# Altium schematic sheet subckt_buffered_tia_dual.SchDoc
size B; SheetNumber: 4; SheetTotal: 5
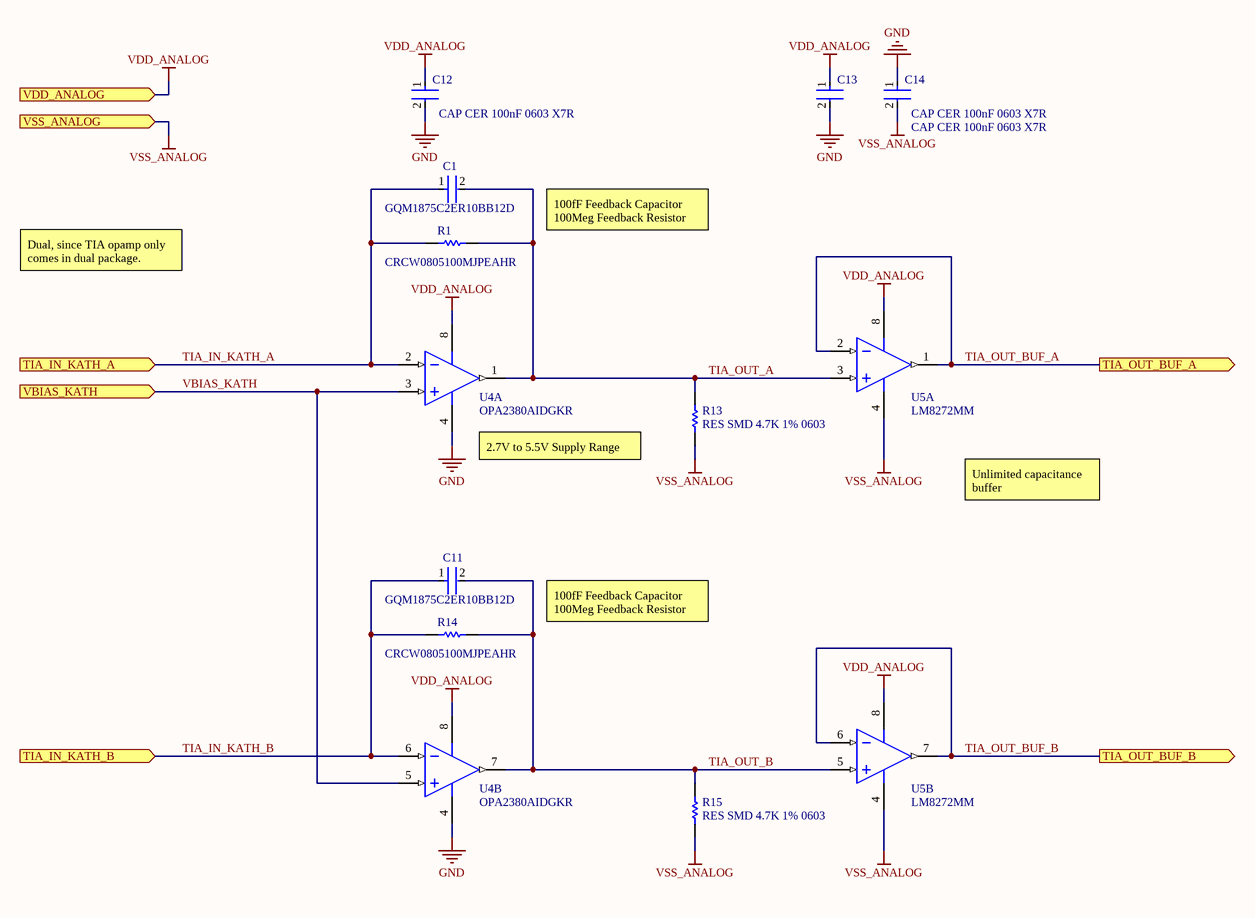
[diagram p0: subckt_buffered_tia_dual.SchDoc]

## Parts
C1  GQM1875C2ER10BB12D  [FP-GQM187-0_15-MFG]
C11  GQM1875C2ER10BB12D  [FP-GQM187-0_15-MFG]
C12  CAP CER 100nF 0603 X7R  [FP-CC0603-DA-MFG]
C13  CAP CER 100nF 0603 X7R  [FP-CC0603-DA-MFG]
C14  CAP CER 100nF 0603 X7R  [FP-CC0603-DA-MFG]
R1  CRCW0805100MJPEAHR  [RESC2013X50X30NL20T20]
R13  RES SMD 4.7K 1% 0603  [RESC1609X55X30LL15T15]
R14  CRCW0805100MJPEAHR  [RESC2013X50X30NL20T20]
R15  RES SMD 4.7K 1% 0603  [RESC1609X55X30LL15T15]
U4  OPA2380AIDGKR  [DGK0008A_N]  (parts A,B of 2)
U5  LM8272MM  [DGK0008A_L]  (parts A,B of 2)

## Ports
TIA_IN_KATH_A (in), TIA_IN_KATH_B (in), TIA_OUT_BUF_A (out), TIA_OUT_BUF_B (out), VBIAS_KATH (in), VDD_ANALOG (in), VSS_ANALOG (in)

## Nets
GND: C12.2 C13.2 C14.1 U4.4(V-)
VDD_ANALOG: C12.1 C13.1 U4.8(V+) U5.8(V+) ; port VDD_ANALOG
VSS_ANALOG: C14.2 R13.1 R15.1 U5.4(V-) ; port VSS_ANALOG
TIA_IN_KATH_A: C1.1 R1.1 U4.2(IN_A-) ; port TIA_IN_KATH_A
TIA_IN_KATH_B: C11.1 R14.1 U4.6(IN_B-) ; port TIA_IN_KATH_B
TIA_OUT_A: C1.2 R1.2 R13.2 U4.1(OUT_A) U5.3(INA+)
TIA_OUT_B: C11.2 R14.2 R15.2 U4.7(OUT_B) U5.5(INB+)
TIA_OUT_BUF_A: U5.1(OUTA) U5.2(INA-) ; port TIA_OUT_BUF_A
TIA_OUT_BUF_B: U5.6(INB-) U5.7(OUTB) ; port TIA_OUT_BUF_B
VBIAS_KATH: U4.3(IN_A+) U4.5(IN_B+) ; port VBIAS_KATH

## Notes on the sheet
- 100fF Feedback Capacitor
  100Meg Feedback Resistor
- Dual, since TIA opamp only comes in dual package.
- (near U4) 2.7V to 5.5V Supply Range
- Unlimited capacitance buffer

## Library data of the parts
C1 C11 = CMP-06035-052255-1: Ceramic Capacitor 0.1pF ±0.1pF 250VDC C0G 0603 Paper T/R; Voltage Rating: 250V; Width: 0.031inch; Length: 1.6mm; Max Operating Temperature: 125°C; Min Operating Temperature: -55°C; Height: 0.7mm; Dielectric: C0G; Termination: SMD/SMT; Depth: 0.8mm; Case/Package: 0603; Package Quantity: 4000; Radiation Hardening: No; Case Code (Metric): 1608; Thickness: 0.031inch; Capacitance: 0.1pF; Case Code (Imperial): 0603; Voltage Rating (DC): 250V; Packaging: Tape and Reel; Mount: Surface Mount
C12-C14 = CMP-03422-000030-1: CAP CER 0.1UF 16V X7R 0603; Manufacturer Part Number: CC0603KRX7R7BB104; Manufacturer: YAGEO; Tolerance: 0.1; Temperature Coefficient: 15%; Material: Ceramic; Voltage Rating: 16 V; Package: CC0603-DA; ComponentLink2Description: Datasheet; Octopart: https://octopart.com/cc0603krx7r7bb104-yageo-192941; Temperature Range High: +125°C; Digikey Description: CAP CER 0.1UF 16V X7R 0603; Value: 100 nF; Voltage: 16 V; Device Class L2: Capacitors; Height: 0.9mm; Temperature: -55°C to +125°C; Device Class L1: Passive Components; Device Class L3: Ceramic Capacitors; ComponentLink2URL: http://www.yageo.com/documents/recent/UPY-GPHC_X7R_6.3V-to-50V_18.pdf; Footprint Url: http://www.yageo.com/exep/pages/download/literatures/UPY-C_GEN_24.pdf; RoHS: TRUE; Temperature Range Low: -55°C; Temperature Characteristic: X7R; Lead Free: Yes; Capacitance: 100 nF; Category: Cap; Mouser Description: Multilayer Ceramic Capacitor, CC Series, 0.1 - F, - 10%, X7R, 16 V, 0603 [1608 Metric]; Automotive: No
R1 R14 = CMP-2001-04281-1: Manufacturer: Vishay Dale; Part Number: CRCW0805100MJPEAHR
R13 R15 = CMP-2000-07452-1: Chip Resistor, 10 KOhm, +/- 1%, 0.1 W, -55 to 155 degC, 0603 (1608 Metric), RoHS, Tape and Reel; Manufacturer: Panasonic; Voltage Rating: 75V; Case\/Package: 0603; Power Rating: 100mW; Resistance: 10KOhm; Temperature Coefficient: 100ppm\/degreesC; Number of Pins: 2; Package Reference: 603; Depth: 0.8mm; Mount: SurfaceMount; Package Description: 2-Pin Surface Mount Device, Body 1.6 x 0.85 mm; Datasheet Version: 02/2017; Length: 1.6mm; Lead Free: LeadFree; Height: 0.45mm; Number of Terminations: 2; Max Power Dissipation: 100mW; Min Operating Temperature: -55degC; Datasheet URL: https://industrial.panasonic.com/cdbs/www-data/pdf/RDA0000/AOA0000C304.pdf; Termination: SMD/SMT; Case Code (Metric): 1608; Case Code (Imperial): 0603; Tolerance: 1%; Max Operating Temperature: 155degC; RoHSCompliant: true; Voltage Rating (DC): 75V; Radiation Hardening: No; Packaging: TapeandReel; Composition: ThickFilm; Mounting Technology: SurfaceMount; Manufacturer URL: http://www.panasonic.com/; Width: 0.031inch; REACH SVHC: NoSVHC; Contact Plating: Tin; Military Standard: Not; Package Quantity: 1
U4 = CMP-0018-00593-2: High Speed Precision Transimpedance Amplifier, 2.7 to 5.5 V, -40 to 125 degC, 8-pin SOP (DGK8), Green (RoHS & no Sb/Br); Manufacturer: Texas Instruments; Iq per channel(Max)(mA): 8.8; Slew Rate(Typ)(V/us): 80; Number of Channels: 2; Vn at Flatband(Typ)(nV/rtHz): 3; Vio(Max)(mV): 0.025; Iib(Max)(nA): 0.05; Vs(Min)(V): 2.7; Vs(Max)(V): 5.5; Sub Family: High Speed Amplifier (>=50MHz), Low Offset Voltage Amplifier (<=500uV), Low Supply Voltage Amplifier (<=2.7V); PackageReference: DGK0008A; ComponentLink3Description: Package Specification; PartNumber: OPA2380AIDGKR; DatasheetVersion: SBOS291G; ComponentLink1URL: http://www.ti.com/; PackageDescription: 8-Pin Thin Small Outline, Body 3 x 3 mm, Pitch 0.65 mm; Code_JEDEC: MO-187; Mounting Technology: Surface Mount; ComponentLink3URL: http://www.ti.com/litv/pdf/mpds028d; ComponentLink2URL: http://www.ti.com/general/docs/lit/getliterature.tsp?genericPartNumber=OPA2380&fileType=pdf; ComponentLink2Description: Datasheet; Eco-Plan: Green (RoHS & no Sb/Br); PackageVersion: 4073329/E, 05/2006; ComponentLink1Description: Manufacturer URL
U5 = CMP-0055-01394-3: RRIO, High Output Current & Unlimited Cap Load Op Amp, 8-pin Mini SOIC; Manufacturer: Texas Instruments; CompType: Amplifiers; PowerWise: N; PackageTopMarking: ZXTT*A60; RoHS: N; ComponentLink1Description: Datasheet URL; PinCount: 8; Code_JEDEC: MO-187-AA; Package Reference: DGK0008A; ComponentLink1URL: http://www.ti.com/general/docs/lit/getliterature.tsp?genericPartNumber=LM8272&fileType=pdf; PackageDescription: MINI SOIC, .118 x .118 x .034in, 8 Lead, .0256in Pitch